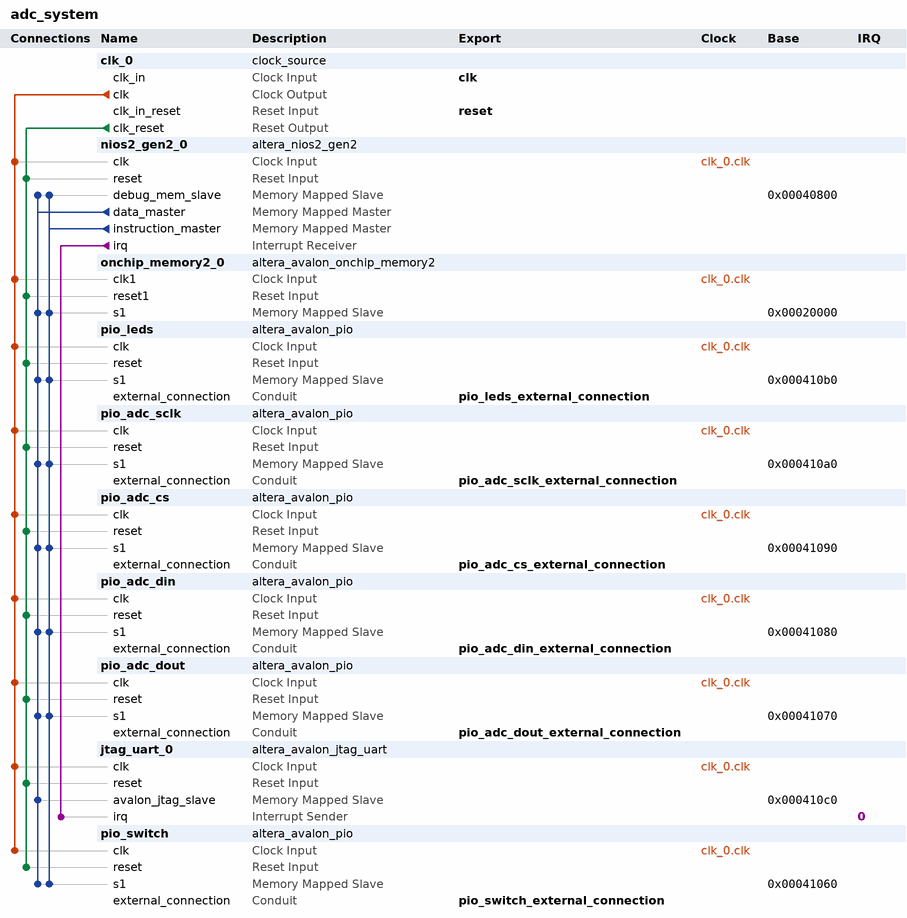
[diagram p0: system contents]
# Platform Designer (Qsys) system adc_system, Cyclone V 5CSEMA5F31C6
# Parameters at their usual value, and those the tool derives, are not listed.
package require -exact qsys 17.1
create_system adc_system
set_project_property DEVICE_FAMILY {Cyclone V}
set_project_property DEVICE 5CSEMA5F31C6

add_instance clk_0 clock_source 17.1
set_instance_parameter_value clk_0 clockFrequency 50000000

add_instance nios2_gen2_0 altera_nios2_gen2 17.1
set_instance_parameter_value nios2_gen2_0 dcache_size 2048
set_instance_parameter_value nios2_gen2_0 exceptionSlave onchip_memory2_0.s1
set_instance_parameter_value nios2_gen2_0 icache_size 4096
set_instance_parameter_value nios2_gen2_0 impl Tiny
set_instance_parameter_value nios2_gen2_0 resetSlave onchip_memory2_0.s1

add_instance onchip_memory2_0 altera_avalon_onchip_memory2 17.1
set_instance_parameter_value onchip_memory2_0 dataWidth 32
set_instance_parameter_value onchip_memory2_0 dualPort false
set_instance_parameter_value onchip_memory2_0 initMemContent true
set_instance_parameter_value onchip_memory2_0 initializationFileName onchip_mem.hex
set_instance_parameter_value onchip_memory2_0 memorySize 131072

add_instance pio_leds altera_avalon_pio 17.1
set_instance_parameter_value pio_leds direction Output
set_instance_parameter_value pio_leds width 10

add_instance pio_adc_sclk altera_avalon_pio 17.1
set_instance_parameter_value pio_adc_sclk direction Output
set_instance_parameter_value pio_adc_sclk width 1

add_instance pio_adc_cs altera_avalon_pio 17.1
set_instance_parameter_value pio_adc_cs direction Output
set_instance_parameter_value pio_adc_cs width 1

add_instance pio_adc_din altera_avalon_pio 17.1
set_instance_parameter_value pio_adc_din direction Output
set_instance_parameter_value pio_adc_din width 1

add_instance pio_adc_dout altera_avalon_pio 17.1
set_instance_parameter_value pio_adc_dout direction Input
set_instance_parameter_value pio_adc_dout width 1

add_instance jtag_uart_0 altera_avalon_jtag_uart 17.1
set_instance_parameter_value jtag_uart_0 simInteractiveOptions NO_INTERACTIVE_WINDOWS

add_instance pio_switch altera_avalon_pio 17.1
set_instance_parameter_value pio_switch direction Input
set_instance_parameter_value pio_switch width 1

# connections
add_connection clk_0.clk jtag_uart_0.clk clock
add_connection clk_0.clk nios2_gen2_0.clk clock
add_connection clk_0.clk onchip_memory2_0.clk1 clock
add_connection clk_0.clk pio_adc_cs.clk clock
add_connection clk_0.clk pio_adc_din.clk clock
add_connection clk_0.clk pio_adc_dout.clk clock
add_connection clk_0.clk pio_adc_sclk.clk clock
add_connection clk_0.clk pio_leds.clk clock
add_connection clk_0.clk pio_switch.clk clock
add_connection clk_0.clk_reset jtag_uart_0.reset reset
add_connection clk_0.clk_reset nios2_gen2_0.reset reset
add_connection clk_0.clk_reset onchip_memory2_0.reset1 reset
add_connection clk_0.clk_reset pio_adc_cs.reset reset
add_connection clk_0.clk_reset pio_adc_din.reset reset
add_connection clk_0.clk_reset pio_adc_dout.reset reset
add_connection clk_0.clk_reset pio_adc_sclk.reset reset
add_connection clk_0.clk_reset pio_leds.reset reset
add_connection clk_0.clk_reset pio_switch.reset reset
add_connection nios2_gen2_0.data_master jtag_uart_0.avalon_jtag_slave avalon
set_connection_parameter_value nios2_gen2_0.data_master/jtag_uart_0.avalon_jtag_slave baseAddress 0x000410c0
add_connection nios2_gen2_0.data_master nios2_gen2_0.debug_mem_slave avalon
set_connection_parameter_value nios2_gen2_0.data_master/nios2_gen2_0.debug_mem_slave baseAddress 0x00040800
add_connection nios2_gen2_0.data_master onchip_memory2_0.s1 avalon
set_connection_parameter_value nios2_gen2_0.data_master/onchip_memory2_0.s1 baseAddress 0x00020000
add_connection nios2_gen2_0.data_master pio_adc_cs.s1 avalon
set_connection_parameter_value nios2_gen2_0.data_master/pio_adc_cs.s1 baseAddress 0x00041090
add_connection nios2_gen2_0.data_master pio_adc_din.s1 avalon
set_connection_parameter_value nios2_gen2_0.data_master/pio_adc_din.s1 baseAddress 0x00041080
add_connection nios2_gen2_0.data_master pio_adc_dout.s1 avalon
set_connection_parameter_value nios2_gen2_0.data_master/pio_adc_dout.s1 baseAddress 0x00041070
add_connection nios2_gen2_0.data_master pio_adc_sclk.s1 avalon
set_connection_parameter_value nios2_gen2_0.data_master/pio_adc_sclk.s1 baseAddress 0x000410a0
add_connection nios2_gen2_0.data_master pio_leds.s1 avalon
set_connection_parameter_value nios2_gen2_0.data_master/pio_leds.s1 baseAddress 0x000410b0
add_connection nios2_gen2_0.data_master pio_switch.s1 avalon
set_connection_parameter_value nios2_gen2_0.data_master/pio_switch.s1 baseAddress 0x00041060
add_connection nios2_gen2_0.instruction_master nios2_gen2_0.debug_mem_slave avalon
set_connection_parameter_value nios2_gen2_0.instruction_master/nios2_gen2_0.debug_mem_slave baseAddress 0x00040800
add_connection nios2_gen2_0.instruction_master onchip_memory2_0.s1 avalon
set_connection_parameter_value nios2_gen2_0.instruction_master/onchip_memory2_0.s1 baseAddress 0x00020000
add_connection nios2_gen2_0.instruction_master pio_adc_cs.s1 avalon
set_connection_parameter_value nios2_gen2_0.instruction_master/pio_adc_cs.s1 baseAddress 0x00041090
add_connection nios2_gen2_0.instruction_master pio_adc_din.s1 avalon
set_connection_parameter_value nios2_gen2_0.instruction_master/pio_adc_din.s1 baseAddress 0x00041080
add_connection nios2_gen2_0.instruction_master pio_adc_dout.s1 avalon
set_connection_parameter_value nios2_gen2_0.instruction_master/pio_adc_dout.s1 baseAddress 0x00041070
add_connection nios2_gen2_0.instruction_master pio_adc_sclk.s1 avalon
set_connection_parameter_value nios2_gen2_0.instruction_master/pio_adc_sclk.s1 baseAddress 0x000410a0
add_connection nios2_gen2_0.instruction_master pio_leds.s1 avalon
set_connection_parameter_value nios2_gen2_0.instruction_master/pio_leds.s1 baseAddress 0x000410b0
add_connection nios2_gen2_0.instruction_master pio_switch.s1 avalon
set_connection_parameter_value nios2_gen2_0.instruction_master/pio_switch.s1 baseAddress 0x00041060
add_connection nios2_gen2_0.irq jtag_uart_0.irq interrupt
set_connection_parameter_value nios2_gen2_0.irq/jtag_uart_0.irq irqNumber 0

# exported interfaces
add_interface clk clock sink
set_interface_property clk EXPORT_OF clk_0.clk_in
add_interface pio_adc_cs_external_connection conduit end
set_interface_property pio_adc_cs_external_connection EXPORT_OF pio_adc_cs.external_connection
add_interface pio_adc_din_external_connection conduit end
set_interface_property pio_adc_din_external_connection EXPORT_OF pio_adc_din.external_connection
add_interface pio_adc_dout_external_connection conduit end
set_interface_property pio_adc_dout_external_connection EXPORT_OF pio_adc_dout.external_connection
add_interface pio_adc_sclk_external_connection conduit end
set_interface_property pio_adc_sclk_external_connection EXPORT_OF pio_adc_sclk.external_connection
add_interface pio_leds_external_connection conduit end
set_interface_property pio_leds_external_connection EXPORT_OF pio_leds.external_connection
add_interface pio_switch_external_connection conduit end
set_interface_property pio_switch_external_connection EXPORT_OF pio_switch.external_connection
add_interface reset reset sink
set_interface_property reset EXPORT_OF clk_0.clk_in_reset

set_interconnect_requirement {$system} qsys_mm.clockCrossingAdapter HANDSHAKE
set_interconnect_requirement {$system} qsys_mm.enableEccProtection FALSE
set_interconnect_requirement {$system} qsys_mm.insertDefaultSlave FALSE
set_interconnect_requirement {$system} qsys_mm.maxAdditionalLatency 1

save_system adc_system.qsys
